# Altium schematic sheet WL-POWER.SchDoc
size 420 x 297 mm; DocumentNumber: ТРАНСИВЕР «ВОЛК»; SheetNumber: 8
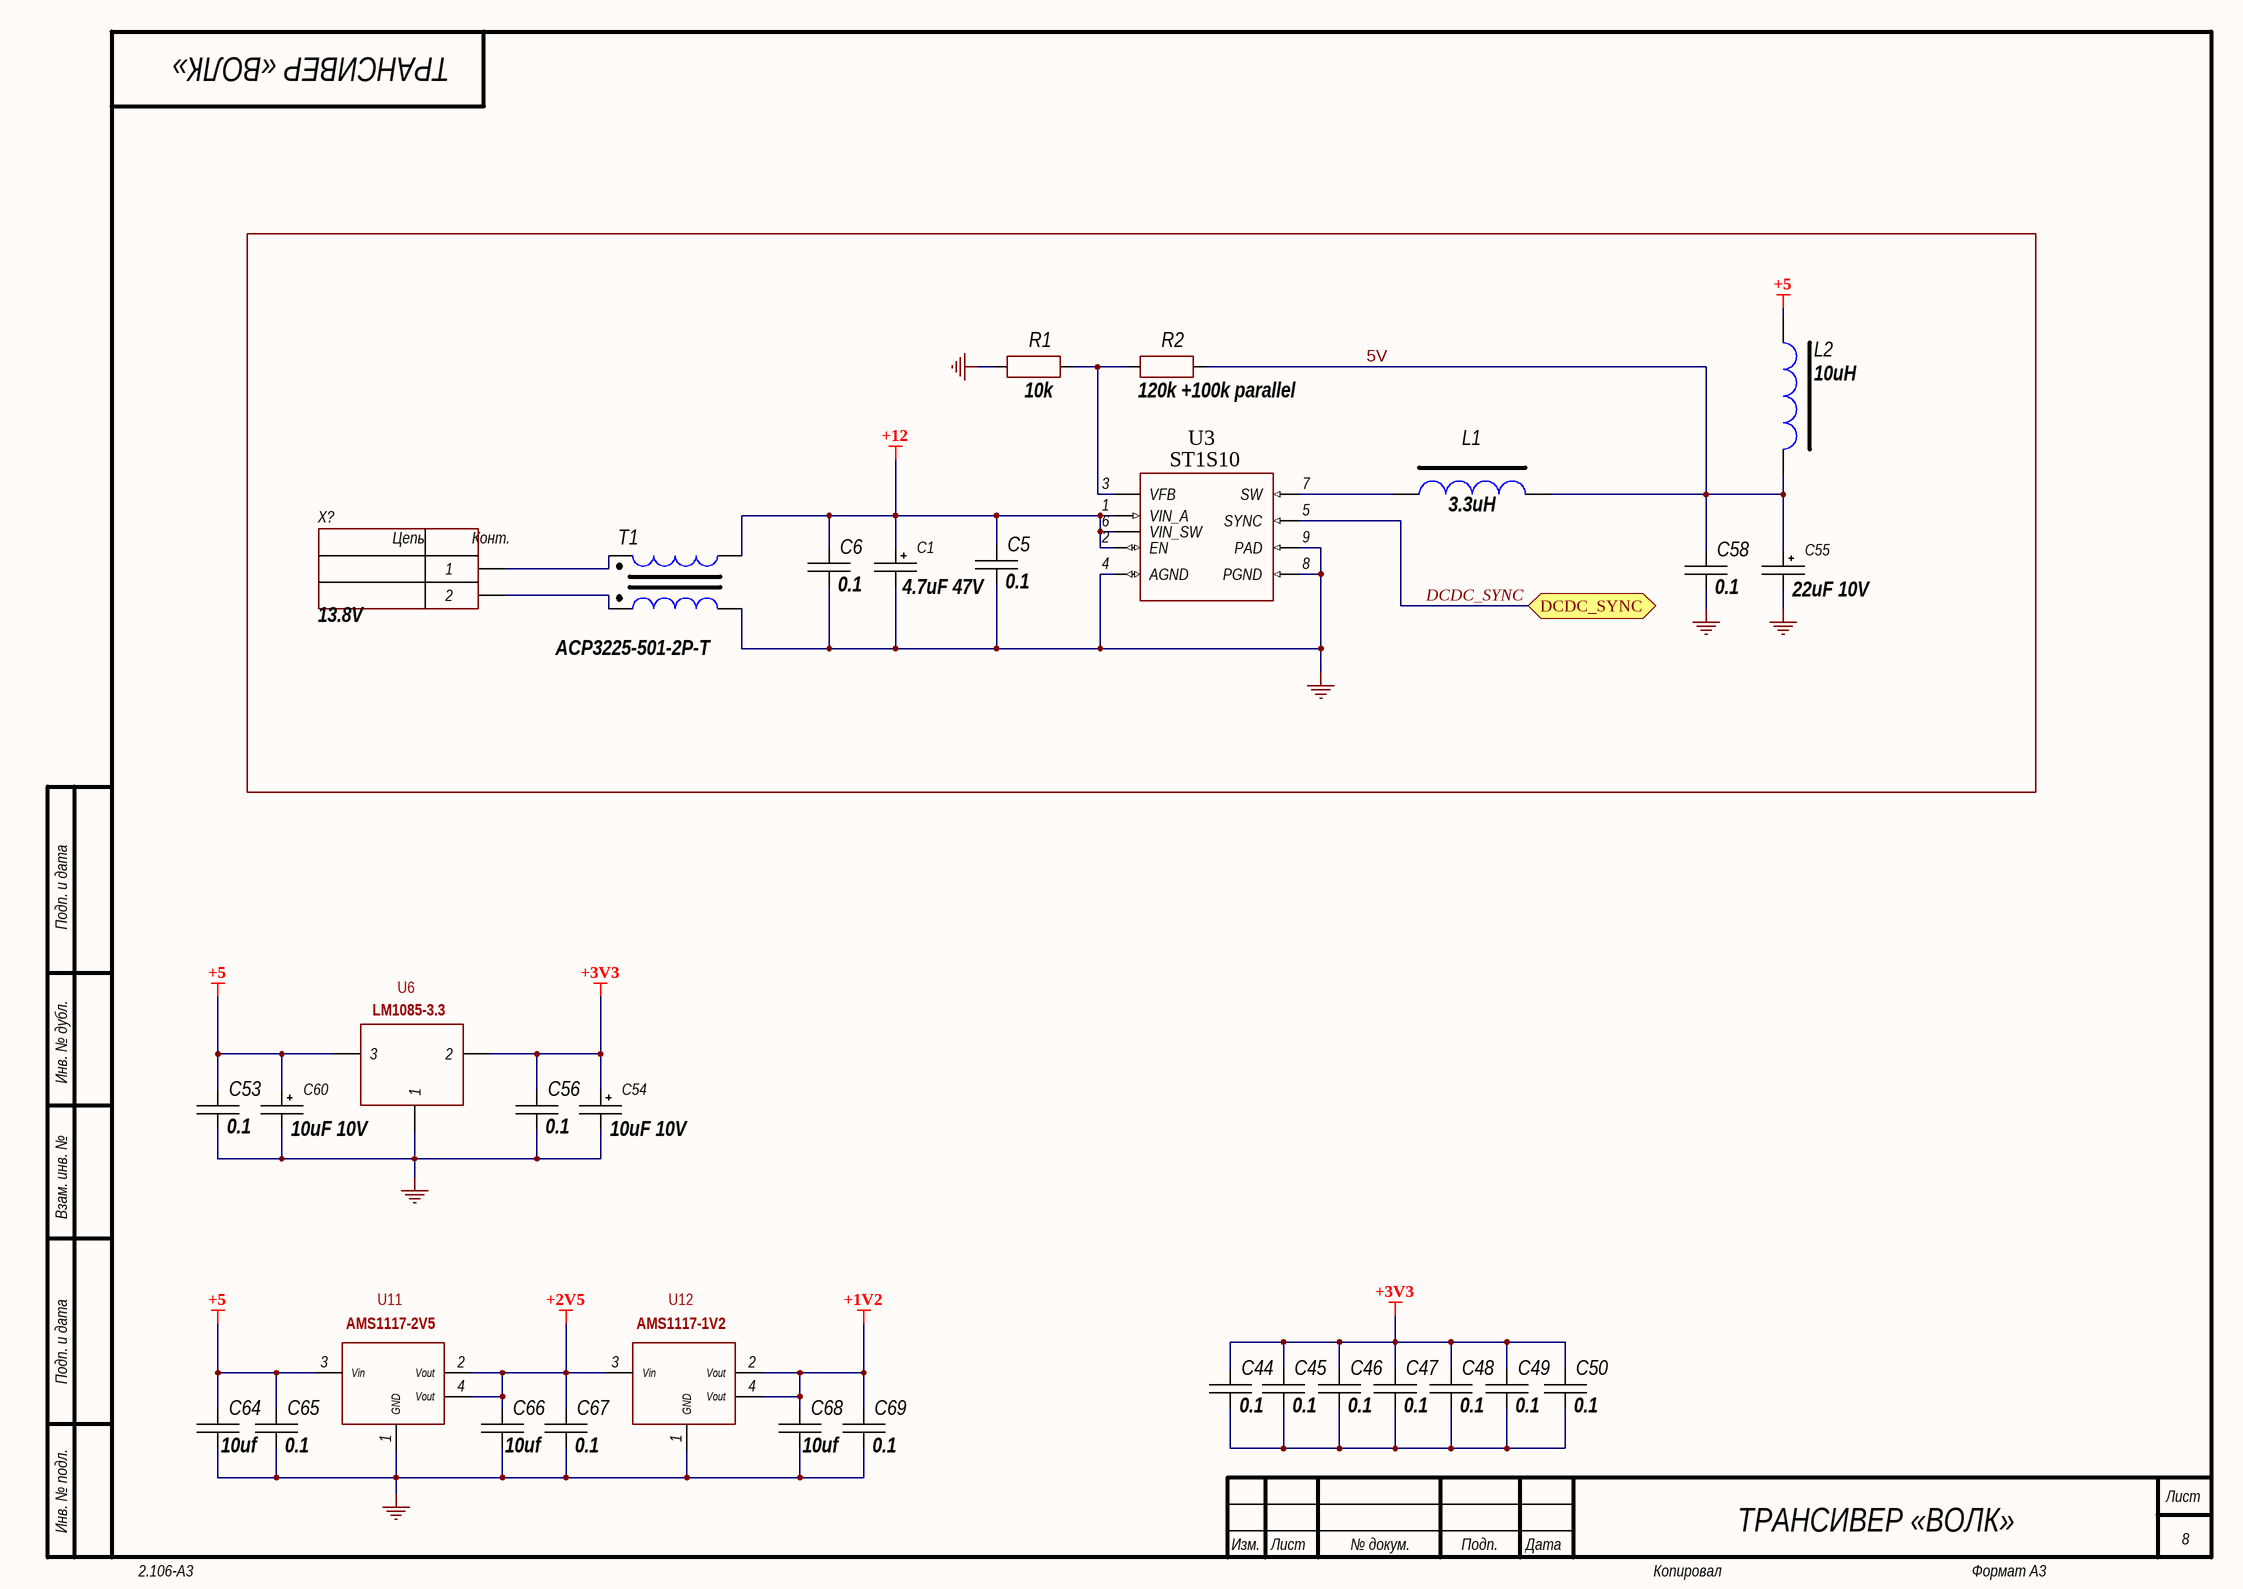
[diagram p0: WL-POWER.SchDoc]

## Parts
C1  4.7uF 47V  [TANTAL_B]
C5  0.1  [CH0805C]
C6  0.1  [CH0805C]
C44  0.1  [CH0805C]
C45  0.1  [CH0805C]
C46  0.1  [CH0805C]
C47  0.1  [CH0805C]
C48  0.1  [CH0805C]
C49  0.1  [CH0805C]
C50  0.1  [CH0805C]
C53  0.1  [CH0805C]
C54  10uF 10V  [TANTAL_B]
C55  22uF 10V  [TANTAL_B]
C56  0.1  [CH0805C]
C58  0.1  [CH0805C]
C60  10uF 10V  [TANTAL_B]
C64  10uf  [CH0805C]
C65  0.1  [CH0805C]
C66  10uf  [CH0805C]
C67  0.1  [CH0805C]
C68  10uf  [CH0805C]
C69  0.1  [CH0805C]
L1  3.3uH
L2  10uH
R1  10k  [CH0805R]
R2  120k +100k parallel  [CH0805R]
T1  ACP3225-501-2P-T  [TRANS: DLW21]
U3  ST1S10  [8-SOIC (PAD)]
U6  LM1085-3.3  [TO-263-3]
U11  AMS1117-2V5  [SOT223]
U12  AMS1117-1V2  [SOT223]
X?  13.8V  [CON: 300-02P-5.0]

## Ports
DCDC_SYNC (bidir)

## Nets
+1V2: C68.1 C69.1 U12.2(Vout) U12.4(Vout)
+2V5: C66.1 C67.1 U11.2(Vout) U11.4(Vout) U12.3(Vin)
+3V3: C44.1 C45.1 C46.1 C47.1 C48.1 C49.1 C50.1 C54.1 C56.1 U6.2
+5: C53.1 C60.1 C64.1 C65.1 L2.2 U6.1(3) U11.3(Vin)
+12: C1.1 C5.1 C6.1 T1.2 U3.1(VIN_A) U3.2(EN) U3.6(VIN_SW)
GND: C1.2 C5.2 C6.2 C53.2 C54.2 C55.2 C56.2 C58.2 C60.2 C64.2 C65.2 C66.2 C67.2 C68.2 C69.2 R1.2 T1.4 U3.4(AGND) U3.8(PGND) U3.9(PAD) U6.3(1) U11.1(GND) U12.1(GND)
5V: C55.1 C58.1 L1.2 L2.1 R2.1
DCDC_SYNC: U3.5(SYNC) ; port DCDC_SYNC
NetC44_2: C44.2 C45.2 C46.2 C47.2 C48.2 C49.2 C50.2
NetL1_1: L1.1 U3.7(SW)
NetR1_1: R1.1 R2.2 U3.3(VFB)
NetT1_1: T1.1 X?.1
NetT1_3: T1.3 X?.2

## Notes on the sheet
- Подп. и дата
- Инв. № дубл.
- Взам. инв. №
- Инв. № подл.
- Изм.
- Лист
- № докум.
- Подп.
- Дата
- 2.106-A3
- Копировал
- Формат А3
- (in symbol 2-Connector) Цепь; Конт.

## Library data of the parts
C1 C54 C55 C60 = TantalCap: Manufacturer: *; Model: *; HelpURL: *; ComponentKind: *; Value: *
C5 C6 C44-C50 C53 C56 C58 C64-C69 = Capacitor: Manufacturer: *; Model: *; HelpURL: *; ComponentKind: *; Value: *
L1 L2 = TRANS
R1 R2 = Resistor: Manufacturer: *; Model: *; HelpURL: *; ComponentKind: *; Value: *
T1 = EMI bead: Manufacturer: Murata Electronics North America; Model: DLW21SN900SQ2L; HelpURL: https://www.digikey.com/product-detail/en/murata-electronics-north-america/DLW21SN900SQ2L/490-5137-1-ND/1922888; ComponentKind: Bead
U6 = 78M09
U11 U12 = AMS117
X? = 2-Connector: Model: *; Manufacturer: *; HelpURL: *; ComponentKind: *